# Altium schematic sheet Test_Jig_USB.SchDoc
size A4; DrawnBy: Philip Rowse
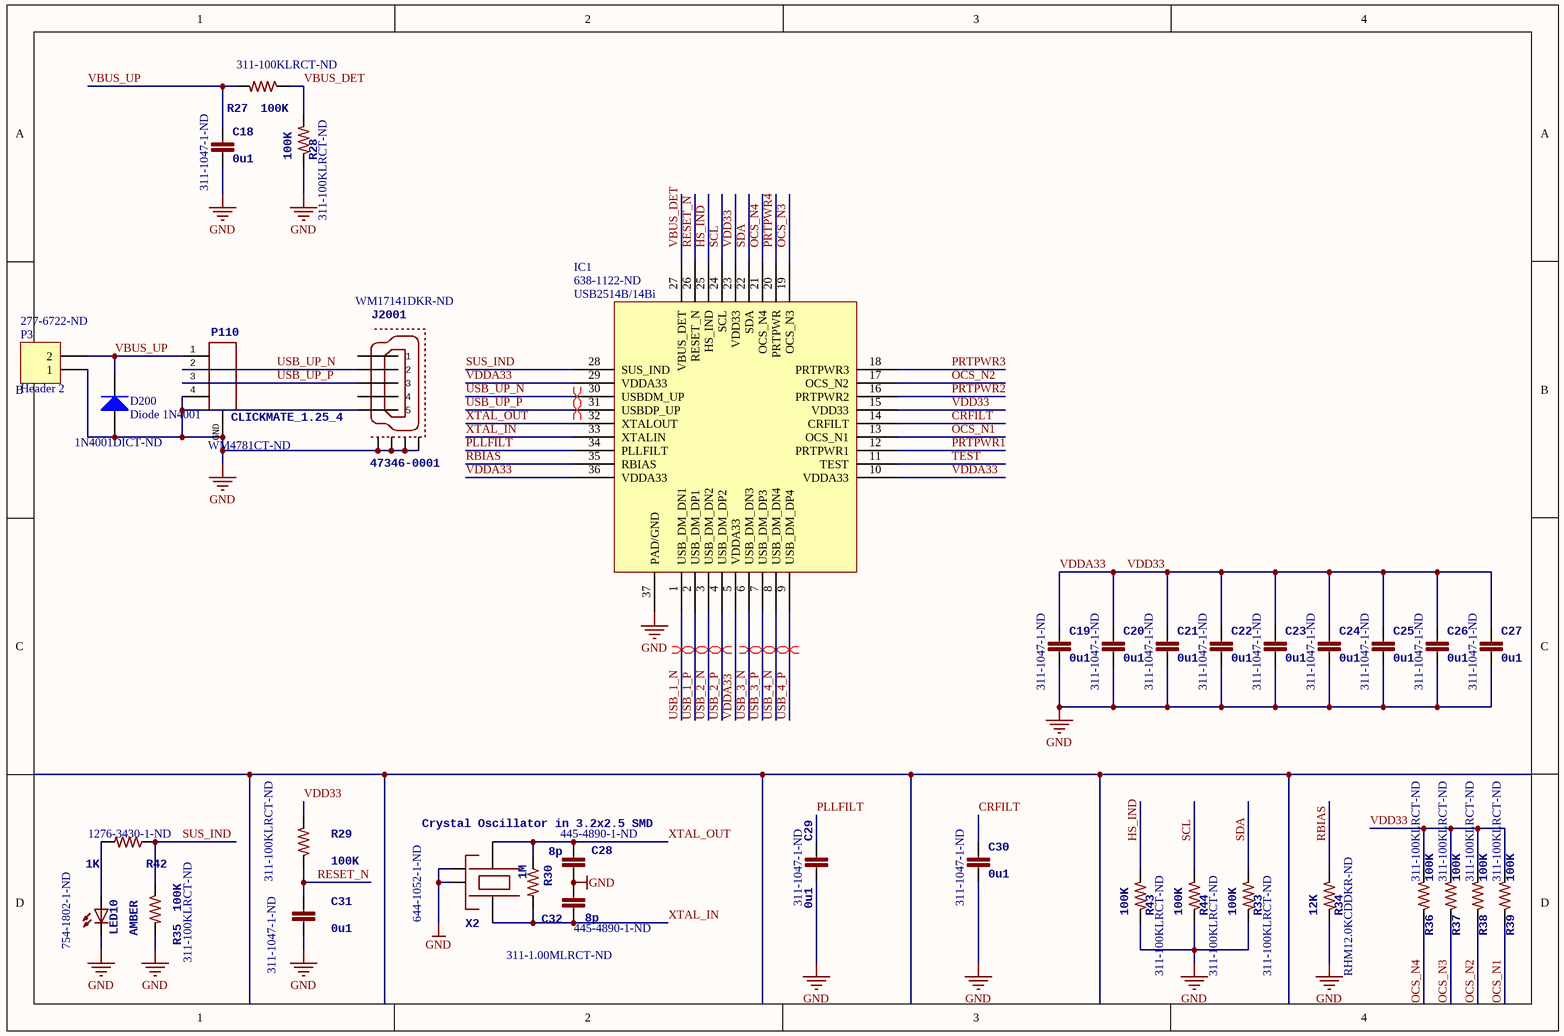
[diagram p0: Test_Jig_USB.SchDoc]

## Parts
C18  0u1  Supplier Part Number 1: 311-1047-1-ND  [0402-CAP]
C19  0u1  Supplier Part Number 1: 311-1047-1-ND  [0402-CAP]
C20  0u1  Supplier Part Number 1: 311-1047-1-ND  [0402-CAP]
C21  0u1  Supplier Part Number 1: 311-1047-1-ND  [0402-CAP]
C22  0u1  Supplier Part Number 1: 311-1047-1-ND  [0402-CAP]
C23  0u1  Supplier Part Number 1: 311-1047-1-ND  [0402-CAP]
C24  0u1  Supplier Part Number 1: 311-1047-1-ND  [0402-CAP]
C25  0u1  Supplier Part Number 1: 311-1047-1-ND  [0402-CAP]
C26  0u1  Supplier Part Number 1: 311-1047-1-ND  [0402-CAP]
C27  0u1  Supplier Part Number 1: 311-1047-1-ND  [0402-CAP]
C28  8p  Supplier Part Number 1: 445-4890-1-ND  [0402-CAP]
C29  0u1  Supplier Part Number 1: 311-1047-1-ND  [0402-CAP]
C30  0u1  Supplier Part Number 1: 311-1047-1-ND  [0402-CAP]
C31  0u1  Supplier Part Number 1: 311-1047-1-ND  [0402-CAP]
C32  8p  Supplier Part Number 1: 445-4890-1-ND  [0402-CAP]
D200  Diode 1N4001  Supplier Part Number 1: 1N4001DICT-ND  [DO-41]
IC1  USB2514B/14Bi  Supplier Part Number 1: 638-1122-ND  [QFN36 USB]
J2001  47346-0001  Supplier Part Number 1: WM17141DKR-ND  [MOLEX-47346-0001]
LED10  AMBER  Supplier Part Number 1: 754-1802-1-ND  [0603-LED]
P3  Header 2  Supplier Part Number 1: 277-6722-ND  [1790283]
P110  CLICKMATE_1.25_4  Supplier Part Number 1: WM4781CT-ND  [CLICKMATE_V4]
R27  100K  Supplier Part Number 1: 311-100KLRCT-ND  [0402-RES]
R28  100K  Supplier Part Number 1: 311-100KLRCT-ND  [0402-RES]
R29  100K  Supplier Part Number 1: 311-100KLRCT-ND  [0402-RES]
R30  1M  Supplier Part Number 1: 311-1.00MLRCT-ND  [0402-RES]
R33  100K  Supplier Part Number 1: 311-100KLRCT-ND  [0402-RES]
R34  12K  Supplier Part Number 1: RHM12.0KCDDKR-ND  [0402-RES]
R35  100K  Supplier Part Number 1: 311-100KLRCT-ND  [0402-RES]
R36  100K  Supplier Part Number 1: 311-100KLRCT-ND  [0402-RES]
R37  100K  Supplier Part Number 1: 311-100KLRCT-ND  [0402-RES]
R38  100K  Supplier Part Number 1: 311-100KLRCT-ND  [0402-RES]
R39  100K  Supplier Part Number 1: 311-100KLRCT-ND  [0402-RES]
R42  1K  Supplier Part Number 1: 1276-3430-1-ND  [0402-RES]
R43  100K  Supplier Part Number 1: 311-100KLRCT-ND  [0402-RES]
R44  100K  Supplier Part Number 1: 311-100KLRCT-ND  [0402-RES]
X2  Crystal Oscillator in 3.2x2.5 SMD  Supplier Part Number 1: 644-1052-1-ND  [OSCILLATOR-3.2X2.5]

## Nets
GND: C18.P$2 C19.P$2 C20.P$2 C21.P$2 C22.P$2 C23.P$2 C24.P$2 C25.P$2 C26.P$2 C27.P$2 C28.P$1 C29.P$2 C30.P$2 C31.P$2 C32.P$2 D200.1(A) IC1.37(PAD/GND) J2001.GND(5) J2001.GND1 J2001.GND2 J2001.GND3 J2001.GND4 LED10.C P3.1 P110.4 P110.GND R28.P$1 R33.P$1 R34.P$1 R35.P$2 R43.P$1 R44.P$1 X2.2(NC_2) X2.4(NC_4)
CRFILT: C30.P$1 IC1.14(CRFILT)
HS_IND: IC1.25(HS_IND) R43.P$2
OCS_N1: IC1.13(OCS_N1) R39.P$1
OCS_N2: IC1.17(OCS_N2) R38.P$1
OCS_N3: IC1.19(OCS_N3) R37.P$1
OCS_N4: IC1.21(OCS_N4) R36.P$1
PLLFILT: C29.P$1 IC1.34(PLLFILT)
PRTPWR1: IC1.12(PRTPWR1)
PRTPWR2: IC1.16(PRTPWR2)
PRTPWR3: IC1.18(PRTPWR3)
PRTPWR4: IC1.20(PRTPWR)
RBIAS: IC1.35(RBIAS) R34.P$2
RESET_N: C31.P$1 IC1.26(RESET_N) R29.P$1
SCL: IC1.24(SCL) R44.P$2
SDA: IC1.22(SDA) R33.P$2
SUS_IND: IC1.28(SUS_IND) R35.P$1 R42.P$1
TEST: IC1.11(TEST)
USB_1_N: IC1.1(USB_DM_DN1)
USB_1_P: IC1.2(USB_DM_DP1)
USB_2_N: IC1.3(USB_DM_DN2)
USB_2_P: IC1.4(USB_DM_DP2)
USB_3_N: IC1.6(USB_DM_DN3)
USB_3_P: IC1.7(USB_DM_DP3)
USB_4_N: IC1.8(USB_DM_DN4)
USB_4_P: IC1.9(USB_DM_DP4)
USB_UP_N: IC1.30(USBDM_UP) J2001.D-(2) P110.2
USB_UP_P: IC1.31(USBDP_UP) J2001.D+(3) P110.3
VBUS_DET: IC1.27(VBUS_DET) R27.P$1 R28.P$2
VBUS_UP: C18.P$1 D200.2(K) P3.2 P110.1 R27.P$2
VDD33: C19.P$1 C20.P$1 C21.P$1 C22.P$1 C23.P$1 C24.P$1 C25.P$1 C26.P$1 C27.P$1 IC1.5(VDDA33) IC1.10(VDDA33) IC1.15(VDD33) IC1.23(VDD33) IC1.29(VDDA33) IC1.36(VDDA33) R29.P$2 R36.P$2 R37.P$2 R38.P$2 R39.P$2  [also labelled VDDA33]
XTAL_IN: C32.P$1 IC1.33(XTALIN) R30.P$2 X2.3
XTAL_OUT: C28.P$2 IC1.32(XTALOUT) R30.P$1 X2.1
NetLED10_A: LED10.A R42.P$2

Not connected (* = marked no-connect by the designer): J2001 ID(4) VBUS(1)

## Layout directives
differential pair: USB_1_N, USB_1_P, USB_2_N, USB_2_P, USB_3_N, USB_3_P, USB_4_N, USB_4_P, USB_UP_N, USB_UP_P

## Library data of the parts
C18-C27 C29-C31 = CAP0402: CAP CER 0.1UF 16V Y5V 0402; PARTNO: CC0402ZRY5V7BB104; 3DR_PARTNO: ECM0700; Supplier 1: Digi-Key; Value: 0u1
C28 C32 = CAP0402: CAP CER 8PF 50V C0G 0402; PARTNO: C1005C0G1H080C; 3DR_PARTNO: ECM0710; Supplier 1: Digi-Key; Value: 8p
D200 = Diode 1N4001: 1 Amp General Purpose Rectifier; Published: 8-Jun-2000; LatestRevisionDate: 17-Jul-2002; LatestRevisionNote: Re-released for DXP Platform.; DatasheetVersion: 1998; PackageVersion: Aug-1999; PackageReference: DO-41; Publisher: Altium Limited; PackageDescription: Diode, Axial; Body 5.2 x 2.7 mm (LxDia. max), Lead Dia. 0.86 mm (max); Code_JEDEC: DO-204-AL; ComponentLink1Description: Manufacturer Link; ComponentLink1URL: http://www.fairchildsemi.com/; ComponentLink2Description: Datasheet; ComponentLink2URL: http://www.fairchildsemi.com/ds/1N%2F1N4001.pdf; Supplier 1: Digi-Key
J2001 = MOLEX-47346-0001: MICRO USB B, BOTTOM MOUNT; 3DR_PARTNO: ECM0486; PARTNO: 0473460001; Supplier 1: Digi-Key
LED10 = LED0603: LED 1.6X0.8 DOME ORN CLEAR SMD; PARTNO: APTD1608SECK; 3DR_PARTNO: ECM0515; Supplier 1: Digi-Key; Value: AMBER
P3 = Header 2: Header, 2-Pin; LatestRevisionDate: 17-Jul-2002; LatestRevisionNote: Re-released for DXP Platform.; Publisher: Altium Limited; Supplier 1: Digi-Key
P110 = CLICKMATE_1.25_4: Connector, Rcpt, 4Pos, 1.25MM, W/B, VERT, SMD, Tin; 3DR_PARTNO: PRT0441; Supplier 1: Digi-Key
R27-R29 R33 R35-R39 R43 R44 = RESISTOR0402-RES: RES 100K OHM 1/16W 1% 0402 SMD; 3DR_PARTNO: ECM0818; PARTNO: RC0402FR-07100KL; Supplier 1: Digi-Key; Value: 100K
R30 = RESISTOR0402-RES: RES 1M OHM 1/16W 1% 0402 SMD; PARTNO: RC0402FR-071ML; 3DR_PARTNO: ECM0806; Supplier 1: Digi-Key; Value: 1M
R34 = RESISTOR0402-RES: RES 12K OHM 1/16W 1% 0402 SMD; Value: 12K; Supplier 1: Digi-Key
R42 = RESISTOR0402-RES: RES 1K OHM 1/16W 1% 0402; PARTNO: RC1005F102CS; 3DR_PARTNO: ECM0804; Supplier 1: Digi-Key; Value: 1K
X2 = OSCILLATOR-3.2X2.5: CRYSTAL 24MHZ 8PF SMD; 3DR_PARTNO: ECM0708; PARTNO: NX3225SA-24.000MHZ-STD-CSR-1; Supplier 1: Digi-Key; Value: 24MHz
IC1 = USB2514B/14Bi: Supplier 1: Digi-Key